# EAGLE design pad (EAGLE 8.1.1)
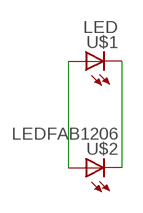
[diagram p0: schematic, sheet 1]

## Parts
U$1  LED  [LED1206]
U$2  LEDFAB1206  [LED1206FAB]

## Nets
N$1: U$1.1(A) U$2.1(A)
N$2: U$1.2(C) U$2.2(C)

## Library data of the parts
U$1 U$2 = fab:LED: LED

## Board
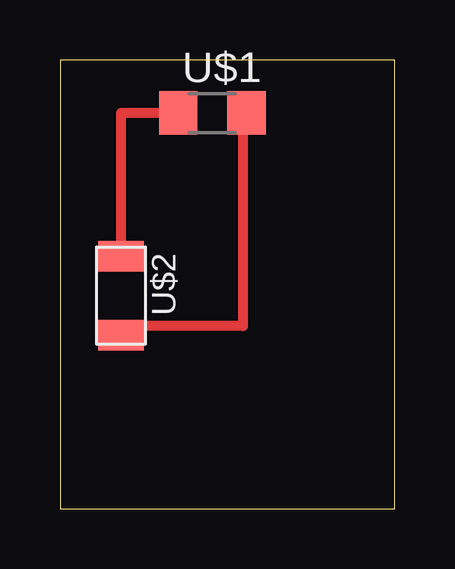
[diagram p1: board, top side]

Size 13.95 x 18.72 mm. Coordinates in mm from the lower left corner, seen from the top.
Outline: 0,0 13.95,0 13.95,18.72 0,18.72 0,0
Copper layers (1*16): Top 0.035mm / dielectric 1.5mm / Bottom 0.035mm
Design rules "default": minimum track width 10mil, minimum drill 24mil, track to track 8mil, track to pad 8mil, pad to pad 8mil, via to via 8mil, smd to smd 8mil, copper to edge 40mil, drill to drill 8mil, minimum pad ring 10mil, minimum via ring 8mil, stop-mask expansion 4mil, vias tented up to drill 0mil, thermal gap 10mil

### Footprints (pad centres in the part's own frame; a part is rotated, then mirrored left to right if it is on the bottom)
LED1206 = smd 1.6 x 1.803: 1 -1.422,0; 2 1.422,0
LED1206FAB = smd 1.27 x 1.905: 1 -1.651,0; 2 1.651,0

### Placement (x,y rotation side)
U$1  6.35,16.51 0 top
U$2  2.54,8.89 270 top

### Tracks (layer width: path | path; a pad name or v marks a point on that pad's centre or on a via)
N$1
  Top 0.406: U$1.1 2.54,16.51 U$2.1
N$2
  Top 0.406: U$1.2 7.62,16.51 7.62,7.62 2.54,7.62 U$2.2